# Altium project Receive_V1.PrjPcb
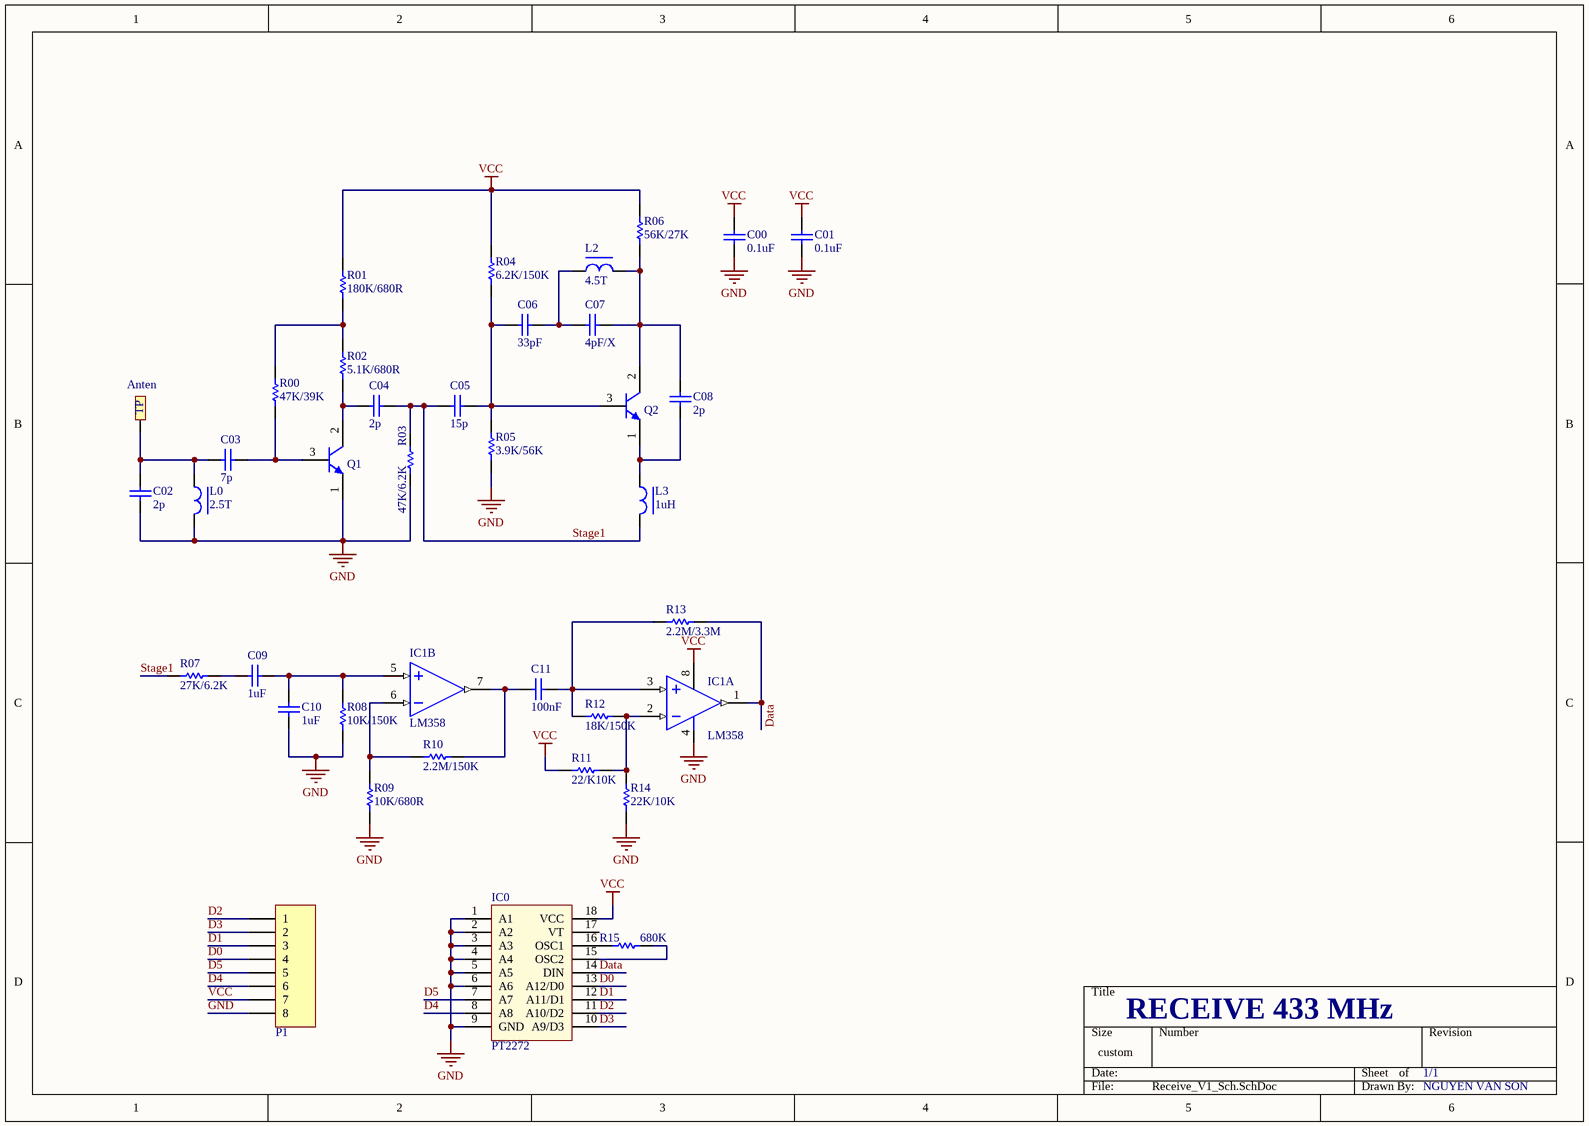
[diagram p0: Receive_V1_Sch.SchDoc]
1 sheet, 37 parts. Net scope: global (net labels, ports and power ports of the same name join across sheets).
Board file: Receive_V1_Pcb.PcbDoc

## Sheet Receive_V1_Sch.SchDoc
size 297 x 209 mm; SheetNumber: 1; SheetTotal: 1

### Parts
Anten  Test Point  [TP]  (value not drawn)
C00  value 0.1uF  [CAP-SM-0603]  (hidden comment: Cap Non-Pol SMD)
C01  value 0.1uF  [CAP-SM-0603]  (hidden comment: Cap Non-Pol SMD)
C02  value 2p  [CAP-SM-0603]  (hidden comment: Cap Non-Pol SMD)
C03  value 7p  [CAP-SM-0805]  (hidden comment: Cap Non-Pol SMD)
C04  value 2p  [CAP-SM-0603]  (hidden comment: Cap Non-Pol SMD)
C05  value 15p  [CAP-SM-0603]  (hidden comment: Cap Non-Pol SMD)
C06  value 33pF  [CAP-SM-0603]  (hidden comment: Cap Non-Pol SMD)
C07  value 4pF/X  [CAP-SM-0603]  (hidden comment: Cap Non-Pol SMD)
C08  value 2p  [CAP-SM-0603]  (hidden comment: Cap Non-Pol SMD)
C09  value 1uF  [CAP-SM-0603]  (hidden comment: Cap Non-Pol SMD)
C10  value 1uF  [CAP-SM-0603]  (hidden comment: Cap Non-Pol SMD)
C11  value 100nF  [CAP-SM-0603]  (hidden comment: Cap Non-Pol SMD)
IC0  PT2272  [DIP18]
IC1  LM358  [SOp 8]  (parts A,B of 2)
L0  2.5T  [L-DIP-M-5.3]
L2  4.5T  [L-DIP-M-5.3]
L3  1uH  [RES-SMD-0805]
P1  Header 8  [JP8]  (value not drawn)
Q1  C1815  [SOT23B]  (value not drawn)
Q2  C1815  [SOT23B]  (value not drawn)
R00  value 47K/39K  [RES-SM-0603]  (hidden comment: RESISTOR SMD)
R01  value 180K/680R  [RES-SM-0603]  (hidden comment: RESISTOR SMD)
R02  value 5.1K/680R  [RES-SM-0805]  (hidden comment: RESISTOR SMD)
R03  value 47K/6.2K  [RES-SM-0603]  (hidden comment: RESISTOR SMD)
R04  value 6.2K/150K  [RES-SM-0805]  (hidden comment: RESISTOR SMD)
R05  value 3.9K/56K  [RES-SM-0805]  (hidden comment: RESISTOR SMD)
R06  value 56K/27K  [RES-SM-0603]  (hidden comment: RESISTOR SMD)
R07  value 27K/6.2K  [RES-SM-0603]  (hidden comment: RESISTOR SMD)
R08  value 10K/150K  [RES-SM-0603]  (hidden comment: RESISTOR SMD)
R09  value 10K/680R  [RES-SM-0603]  (hidden comment: RESISTOR SMD)
R10  value 2.2M/150K  [RES-SM-0603]  (hidden comment: RESISTOR SMD)
R11  value 22/K10K  [RES-SM-0603]  (hidden comment: RESISTOR SMD)
R12  value 18K/150K  [RES-SM-0603]  (hidden comment: RESISTOR SMD)
R13  value 2.2M/3.3M  [RES-SM-0603]  (hidden comment: RESISTOR SMD)
R14  R?: 22K/10K  [RES-SM-0603]  (hidden comment: RESISTOR SMD)
R15  value 680K  [RES-SM-0805]  (hidden comment: RESISTOR SMD)

### Nets
GND: C00.1 C01.1 C02.1 C10.2 IC0.1(A1) IC0.2(A2) IC0.3(A3) IC0.4(A4) IC0.5(A5) IC0.6(A6) IC0.9(GND) IC1.4(-V) L0.2 P1.8 Q1.1(E) R03.2 R05.2 R08.2 R09.2 R14.2
VCC: C00.2 C01.2 IC0.18(VCC) IC1.8(+V) P1.7 R01.1 R04.1 R06.1 R11.2
D0: IC0.13(A12/D0) P1.4
D1: IC0.12(A11/D1) P1.3
D2: IC0.11(A10/D2) P1.1
D3: IC0.10(A9/D3) P1.2
D4: IC0.8(A8) P1.6
D5: IC0.7(A7) P1.5
Data: IC0.14(DIN) IC1.1(OUT) R13.2
Stage1: C04.1 C05.2 L3.2 R03.1 R07.2
NetAnten_TP1: Anten.TP1 C02.2 C03.2 L0.1
NetC03_1: C03.1 Q1.3(B) R00.2
NetC04_2: C04.2 Q1.2(C) R02.2
NetC05_1: C05.1 C06.2 Q2.3(B) R04.2 R05.1
NetC06_1: C06.1 C07.2 L2.1
NetC07_1: C07.1 C08.1 L2.2 Q2.2(C) R06.2
NetC08_2: C08.2 L3.1 Q2.1(E)
NetC09_1: C09.1 C10.1 IC1.5(IN+) R08.1
NetC09_2: C09.2 R07.1
NetC11_1: C11.1 IC1.3(IN+) R12.2 R13.1
NetC11_2: C11.2 IC1.7(OUT) R10.2
NetIC0_15: IC0.15(OSC2) R15.2
NetIC0_16: IC0.16(OSC1) R15.1
NetIC1_2: IC1.2(IN-) R11.1 R12.1 R14.1
NetIC1_6: IC1.6(IN-) R09.1 R10.1
NetR00_1: R00.1 R01.2 R02.1

Not connected (* = marked no-connect by the designer): IC0 17(VT)

### Notes on the sheet
- RECEIVE 433 MHz
- 1/1
- NGUYEN VAN SON
- (in symbol Test Point) TP

### Library data of the parts
C00 C01 C02 C03 C04 C05 C06 C07 C08 C09-C11 = Cap Non-Pol SMD: Capacitor
IC0 = PT2272: Remote Control Decoder
IC1 = LM358: Low-Power Dual Operational Amplifier; Value: LM358
L0 L2 L3 = L-DIP-1: Inductor; Value: 150 mH
P1 = Header 8: Header, 8-Pin; LatestRevisionDate: 17-Jul-2002; LatestRevisionNote: Re-released for DXP Platform.; Publisher: Altium Limited
Q1 Q2 = C1815: NPN Bipolar Transistor
R00 R01 R02 R03 R04 R05 R06 R07 R08 R09-R15 = RESISTOR SMD: Resistor